# Altium schematic sheet main.SchDoc
size 209 x 297 mm; Organization: Altium Limited; Address1: L3, 12a Rodborough Rd; Address2: Frenchs Forest; Address3: NSW; Address4: Australia 2086
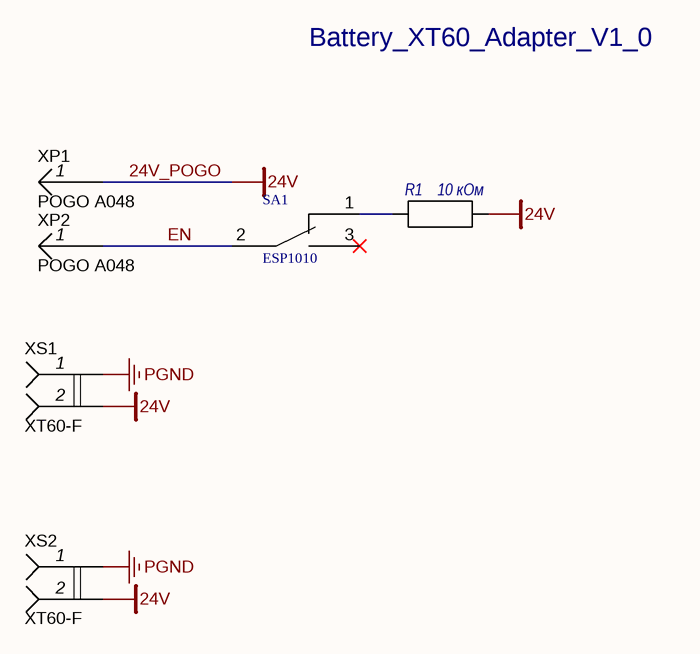
[diagram p0: main.SchDoc]

## Parts
R1  10 кОм  [C0603R]
SA1  ESP1010  [ESP1010]
XP1  POGO A048  [POGO_A048]
XP2  POGO A048  [POGO_A048]
XS1  XT60-F  [XT60-F]
XS2  XT60-F  [XT60-F]

## Nets
24V_POGO: R1.2 XP1.1 XS1.2 XS2.2  [also labelled 24V]
PGND: XS1.1 XS2.1
EN: SA1.2 XP2.1
NetR1_1: R1.1 SA1.1

Not connected (* = marked no-connect by the designer): SA1 3(_)*

## Notes on the sheet
- Battery_XT60_Adapter_V1_0
- Перв. примен.
- Справ. №
- Подп. и дата
- Инв. № дубл.
- Взам. инв. №
- Разраб.
- Изм.
- Лист
- № докум.
- Подп.
- Дата
- Литера
- Масса
- Масштаб
- Пров.
- Т.контр.
- Листов
- Инв. № подл.
- Н.контр.
- Утв.
- Форма 1 ГОСТ 2.104-2006
- Копировал
- Формат А4

## Library data of the parts
R1 = RC0603FR-0710KL: SMD 0603; 0,1; 1%; 10 кОм; Manufacturer: Yageo; Power: 0,1; Part Number: RC0603FR-0710KL; Package: SMD 0603; Persent: 1%; Value: 10 кОм; Category: R
SA1 = ESP1010: SA; Manufacturer: ECE; Part Number: ESP1010; Type: SA
XS1 XS2 = XT60-F: Manufacturer: AMASS; Part Number: XT60-F
XP1 XP2 = POGO A048: Manufacturer: -; Part Number: POGO A048